# EAGLE schematic relay-unit-XRF (EAGLE 6.5.0)
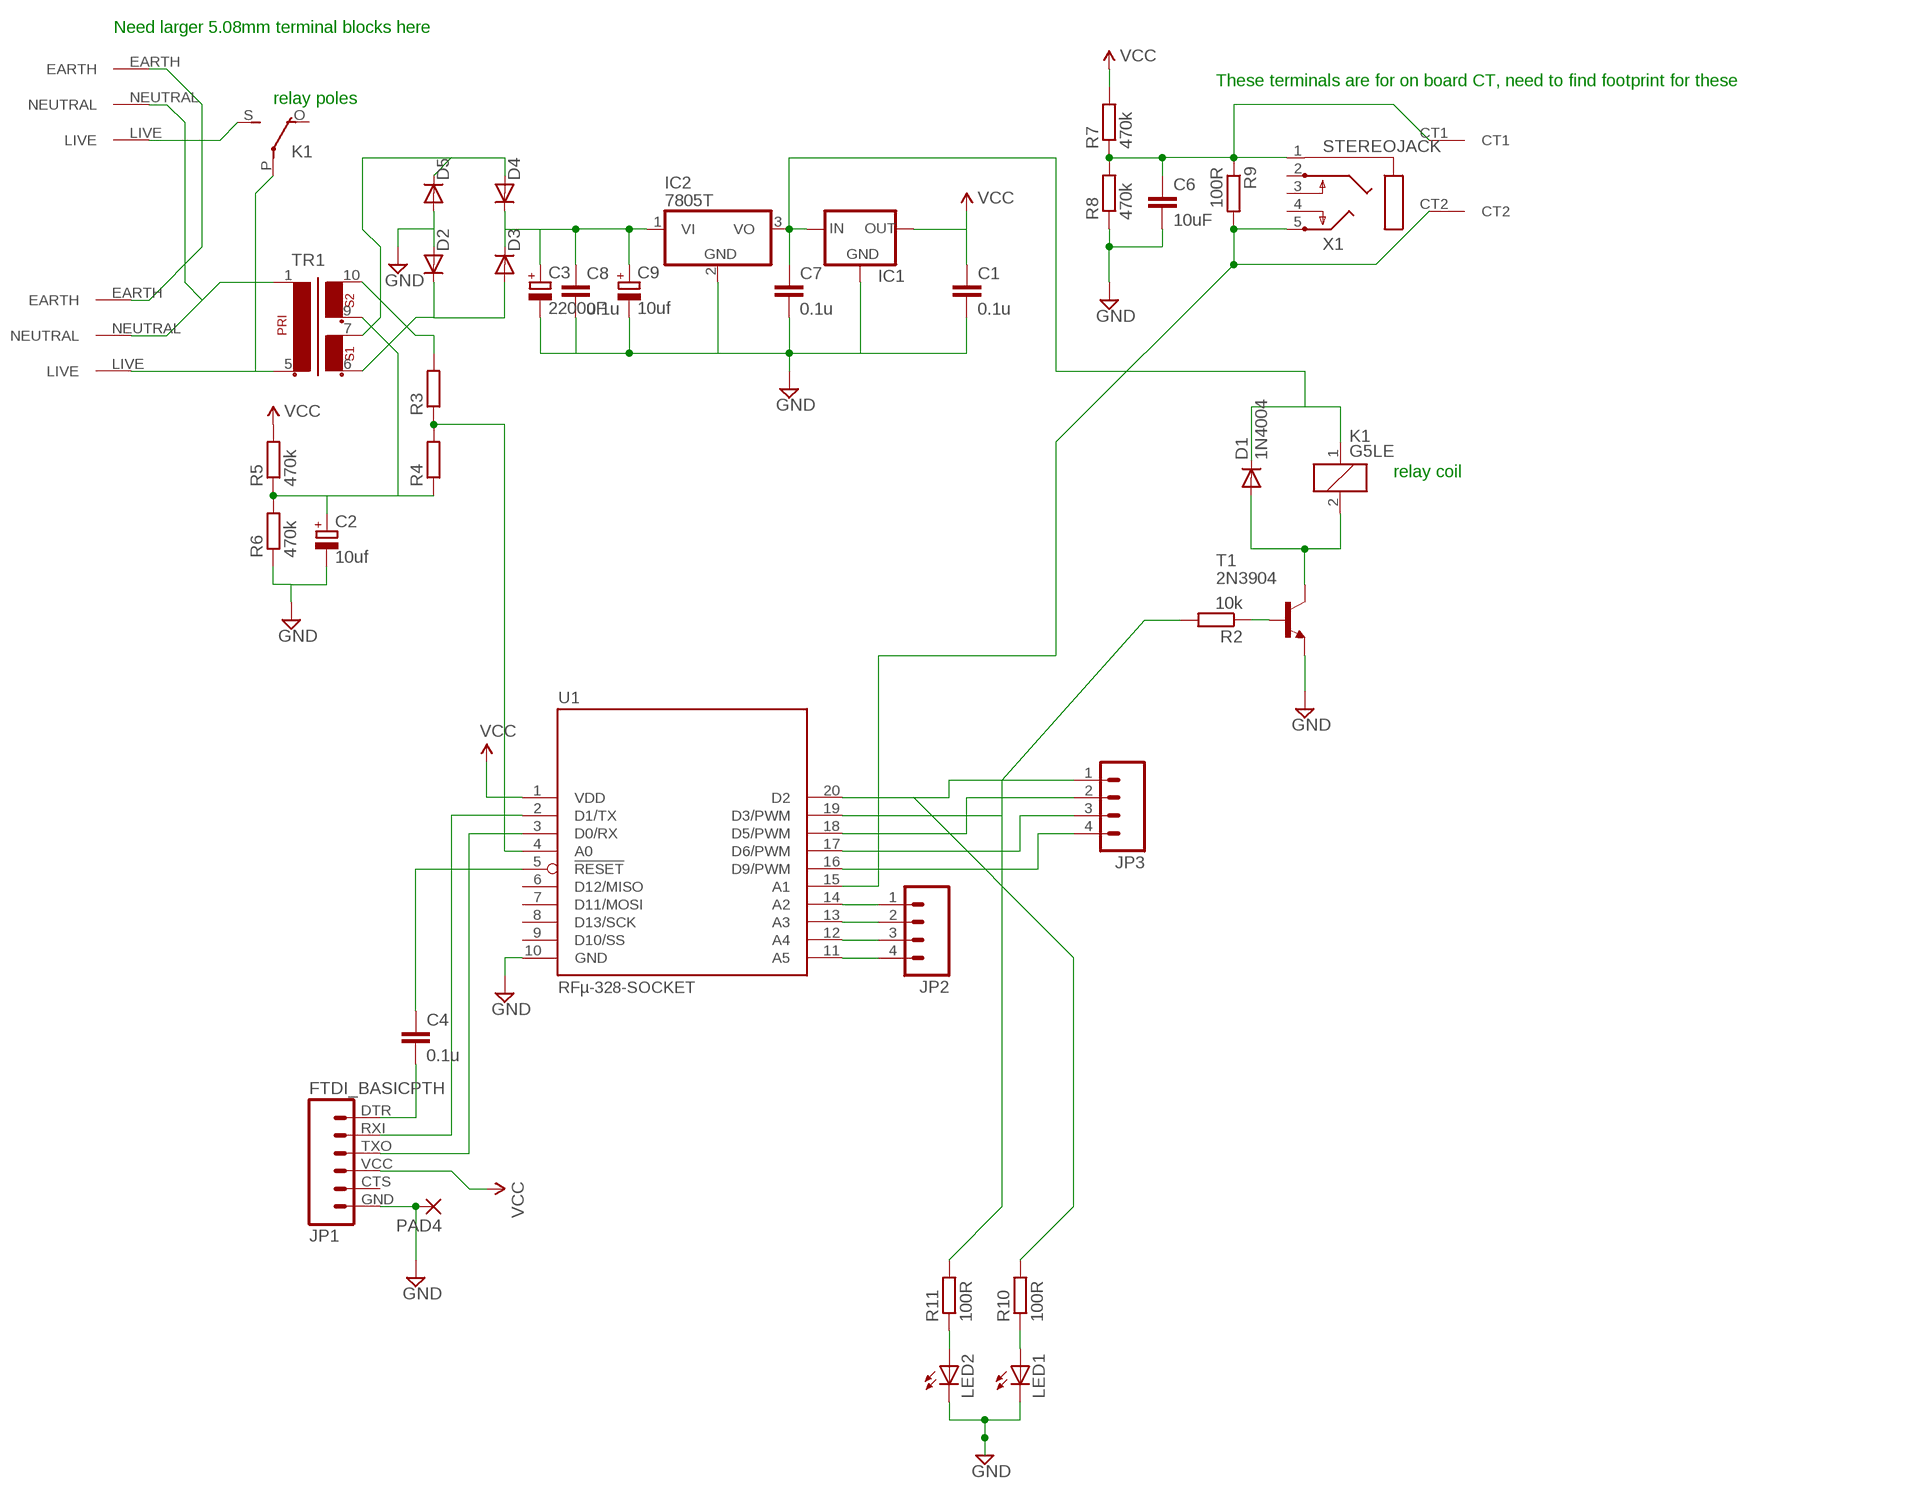
[diagram p0: schematic, sheet 1]

## Parts
C1  0.1u  C-EU025-024X044  [C025-024X044]
C2  10uf  CPOL-EUE1.8-4  [E1,8-4]
C3  2200uF  CPOL-EUE5-13  [E5-13]
C4  0.1u  C-EU025-024X044  [C025-024X044]
C6  10uF  C-EU025-024X044  [C025-024X044]
C7  0.1u  C-EU025-024X044  [C025-024X044]
C8  0.1u  C-EU025-024X044  [C025-024X044]
C9  10uf  CPOL-EUE1.8-4  [E1,8-4]
D1  1N4004  [DO41-10]
D2  1N4004  [DO41-10]
D3  1N4004  [DO41-10]
D4  1N4004  [DO41-10]
D5  1N4004  [DO41-10]
IC1  MCP1700TRI  [TO92]
IC2  7805T  [TO220H]
JP1  FTDI_BASICPTH  [FTDI_BASIC]
JP2  M04PTH  [1X04]
JP3  M04PTH  [1X04]
K1  G5LE  [G5LE]
LED1  LED3MM  [LED3MM]
LED2  LED3MM  [LED3MM]
PAD4  1,6/0,8  [1,6/0,8]
R2  10k  R-EU_0204/7  [0204/7]
R3  R-EU_0204/7  [0204/7]
R4  R-EU_0204/7  [0204/7]
R5  470k  R-EU_0204/7  [0204/7]
R6  470k  R-EU_0204/7  [0204/7]
R7  470k  R-EU_0204/7  [0204/7]
R8  470k  R-EU_0204/7  [0204/7]
R9  100R  R-EU_0204/7  [0204/7]
R10  100R  R-EU_0204/7  [0204/7]
R11  100R  R-EU_0204/7  [0204/7]
T1  2N3904  [TO92]
TR1  EI30-2  [EI30-2]
U1  RFµ-328-SOCKET  [RFµ-328-SOCKET]
U$1  TESTTEST  [TEST]
U$2  AC_IN  [AC_IN]
U$3  CT  [CT]
X1  STEREOJACK  [STX3100]

## Nets
5V: C7.1 D1.C IC1.2(IN) IC2.3(VO) K1.1
GND: C1.2 C2.- C3.- C6.2 C7.2 C8.2 C9.- D2.A D5.A IC1.1(GND) IC2.2(GND) JP1.GND LED1.K(C) LED2.K(C) PAD4.1(P) R6.1 R8.1 T1.3(E) U1.10(GND)
N$1: JP1.RXI U1.2(D1/TX)
N$2: JP1.TXO U1.3(D0/RX)
N$3: C4.2 JP1.DTR
N$4: JP2.1 U1.14(A2)
N$5: JP2.2 U1.13(A3)
N$6: JP2.3 U1.12(A4)
N$7: JP2.4 U1.11(A5)
N$8: C4.1 U1.5(!RESET)
N$9: JP3.1 R10.2 U1.20(D2)
N$10: JP3.2 U1.18(D5/PWM)
N$11: JP3.3 U1.17(D6/PWM)
N$12: JP3.4 U1.16(D9/PWM)
N$13: C3.+ C8.1 C9.+ D3.C D4.C IC2.1(VI)
N$14: R3.2 TR1.10
N$15: R2.1 T1.2(B)
N$16: D1.A K1.2 T1.1(C)
N$17: R2.2 R11.2 U1.19(D3/PWM)
N$19: K1.S(2:S) U$1.LIVE
N$20: TR1.1 U$1.NEUTRAL U$2.NEUTRAL
N$21: C2.+ R4.1 R5.1 R6.2 TR1.9
N$22: D2.C D3.A TR1.6
N$25: R9.2 U1.15(A1) U$3.CT2 X1.5
N$26: C6.1 R7.1 R8.2 R9.1 U$3.CT1 X1.1
N$27: R3.1 R4.2 U1.4(A0)
N$28: D4.A D5.C TR1.7
N$36: U$1.EARTH U$2.EARTH
N$37: LED1.A R10.1
N$38: LED2.A R11.1
N$40: K1.P(2:P) TR1.5 U$2.LIVE
VCC: C1.1 IC1.3(OUT) JP1.VCC R5.2 R7.2 U1.1(VDD)
Unconnected: JP1.CTS K1.O(2:O) U1.6(D12/MISO) U1.7(D11/MOSI) U1.8(D13/SCK) U1.9(D10/SS) X1.2 X1.3 X1.4

## Notes on the sheet
- Need larger 5.08mm terminal blocks here
- These terminals are for on board CT, need to find footprint for these
- relay poles
- relay coil

## Library data of the parts
C1 C4 C6-C8 = resistor:C-EU: CAPACITOR, European symbol
C2 C3 C9 = rcl:CPOL-EU: POLARIZED CAPACITOR, European symbol
D1-D5 = adafruit:1N4004: DIODE General purpose 1N400x type rectifier (With bigger pads) http://www.ladyada.net/library/pcb/eaglelibrary.html
IC1 = adafruit:MCP1700: VOLTAGE REGULATOR
IC2 = adafruit:78*: Positive VOLTAGE REGULATOR Added bigger pads to the TO-92 package
JP1 = SparkFun:FTDI_BASIC: FTDI Basic: 3.3V and 5V
JP2 JP3 = SparkFun:M04: Header 4 Standard 4-pin 0.1" header. Use with straight break away headers (SKU : PRT-00116), right angle break away headers (PRT-00553), swiss pins (PRT-00743), machine pins (PRT-00117), and female headers (PRT-00115). Molex polarized connector foot print use with SKU : PRT-08231 with associated crimp pins and housings. 1MM SMD Version SKU: PRT-10208
K1 = relay:G5LE: RELAY 1 x switch, 10 A/120 V AC, 8 A/30 V DC, Omron; OC_FARNELL: unknown; OC_NEWARK: unknown
LED1 LED2 = adafruit:LED: LED OSRAM: - CHIPLED LG R971, LG N971, LY N971, LG Q971, LY Q971, LO R971, LY R971 LH N974, LH R974 LS Q976, LO Q976, LY Q976 LO Q996 - Hyper CHIPLED LW Q18S LB Q993, LB Q99A, LB R99A - SideLED LS A670, LO A670, LY A670, LG A670, LP A670 LB A673, LV A673, LT A673, LW A673 LH A674 LY A675 LS A676, LA A676, LO A676, LY A676, LW A676 LS A679, LY A679, LG A679 - Hyper Micro SIDELED® LS Y876, LA Y876, LO Y876, LY Y876 LT Y87S - SmartLED LW L88C, LW L88S LB L89C, LB L89S, LG L890 LS L89K, LO L89K, LY L89K LS L896, LA L896, LO L896, LY L896 - TOPLED LS T670, LO T670, LY T670, LG T670, LP T670 LSG T670, LSP T670, LSY T670, LOP T670, LYG T670 LG T671, LOG T671, LSG T671 LB T673, LV T673, LT T673, LW T673 LH T674 LS T676, LA T676, LO T676, LY T676, LB T676, LH T676, LSB T676, LW T676 LB T67C, LV T67C, LT T67C, LS T67K, LO T67K, LY T67K, LW E67C LS E67B, LA E67B, LO E67B, LY E67B, LB E67C, LV E67C, LT E67C LW T67C LS T679, LY T679, LG T679 LS T770, LO T770, LY T770, LG T770, LP T770 LB T773, LV T773, LT T773, LW T773 LH T774 LS E675, LA E675, LY E675, LS T675 LS T776, LA T776, LO T776, LY T776, LB T776 LHGB T686 LT T68C, LB T68C - Hyper Mini TOPLED® LB M676 - Mini TOPLED Santana® LG M470 LS M47K, LO M47K, LY M47K Source: http://www.osram.convergy.de/
PAD4 = wirepad:1,6/0,8: THROUGH-HOLE PAD
R2-R11 = rcl:R-EU_: RESISTOR, European symbol
T1 = transistor:2N3904: NPN TRANSISTOR
TR1 = trafo:EI30-2: TRANSFORMER 1 primary winding, 2 secondary windings ERA
U1 = Ciseco Footprints:RFµ-328
U$1 = trystan:TEST
U$2 = trystan:AC_IN
U$3 = trystan:CT
X1 = adafruit:STEREOJACK: MIC/HEADPHONE JACK Stereo jack with two switches. Kycon STX3100, CUI SJ1-3555NG and/or 4UCon 05544